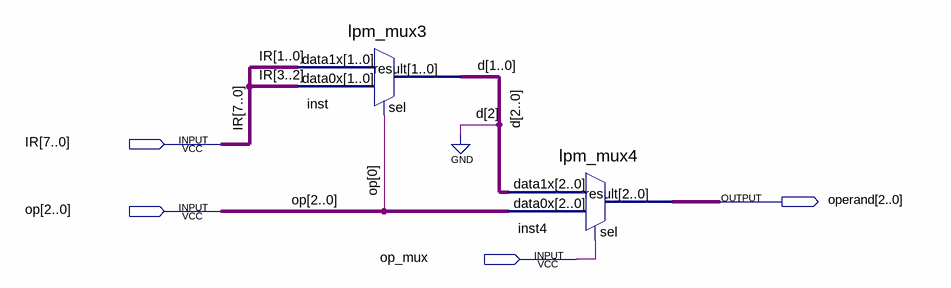
[diagram p0: schematic sheet]
// Quartus schematic ALU_SELECT.bdf as structural Verilog: 2 symbols, 4 pins
module ALU_SELECT (
  input  [7:0] IR,
  input  [2:0] op,
  input  op_mux,
  output [2:0] operand
);

  wire [1:0] d;

  lpm_mux3 inst (.data1x(IR[1:0]), .data0x(IR[3:2]), .sel(op[0]), .result(d));
  lpm_mux4 inst4 (.data1x({1'b0, d}), .data0x(op), .sel(op_mux), .result(operand));
endmodule
